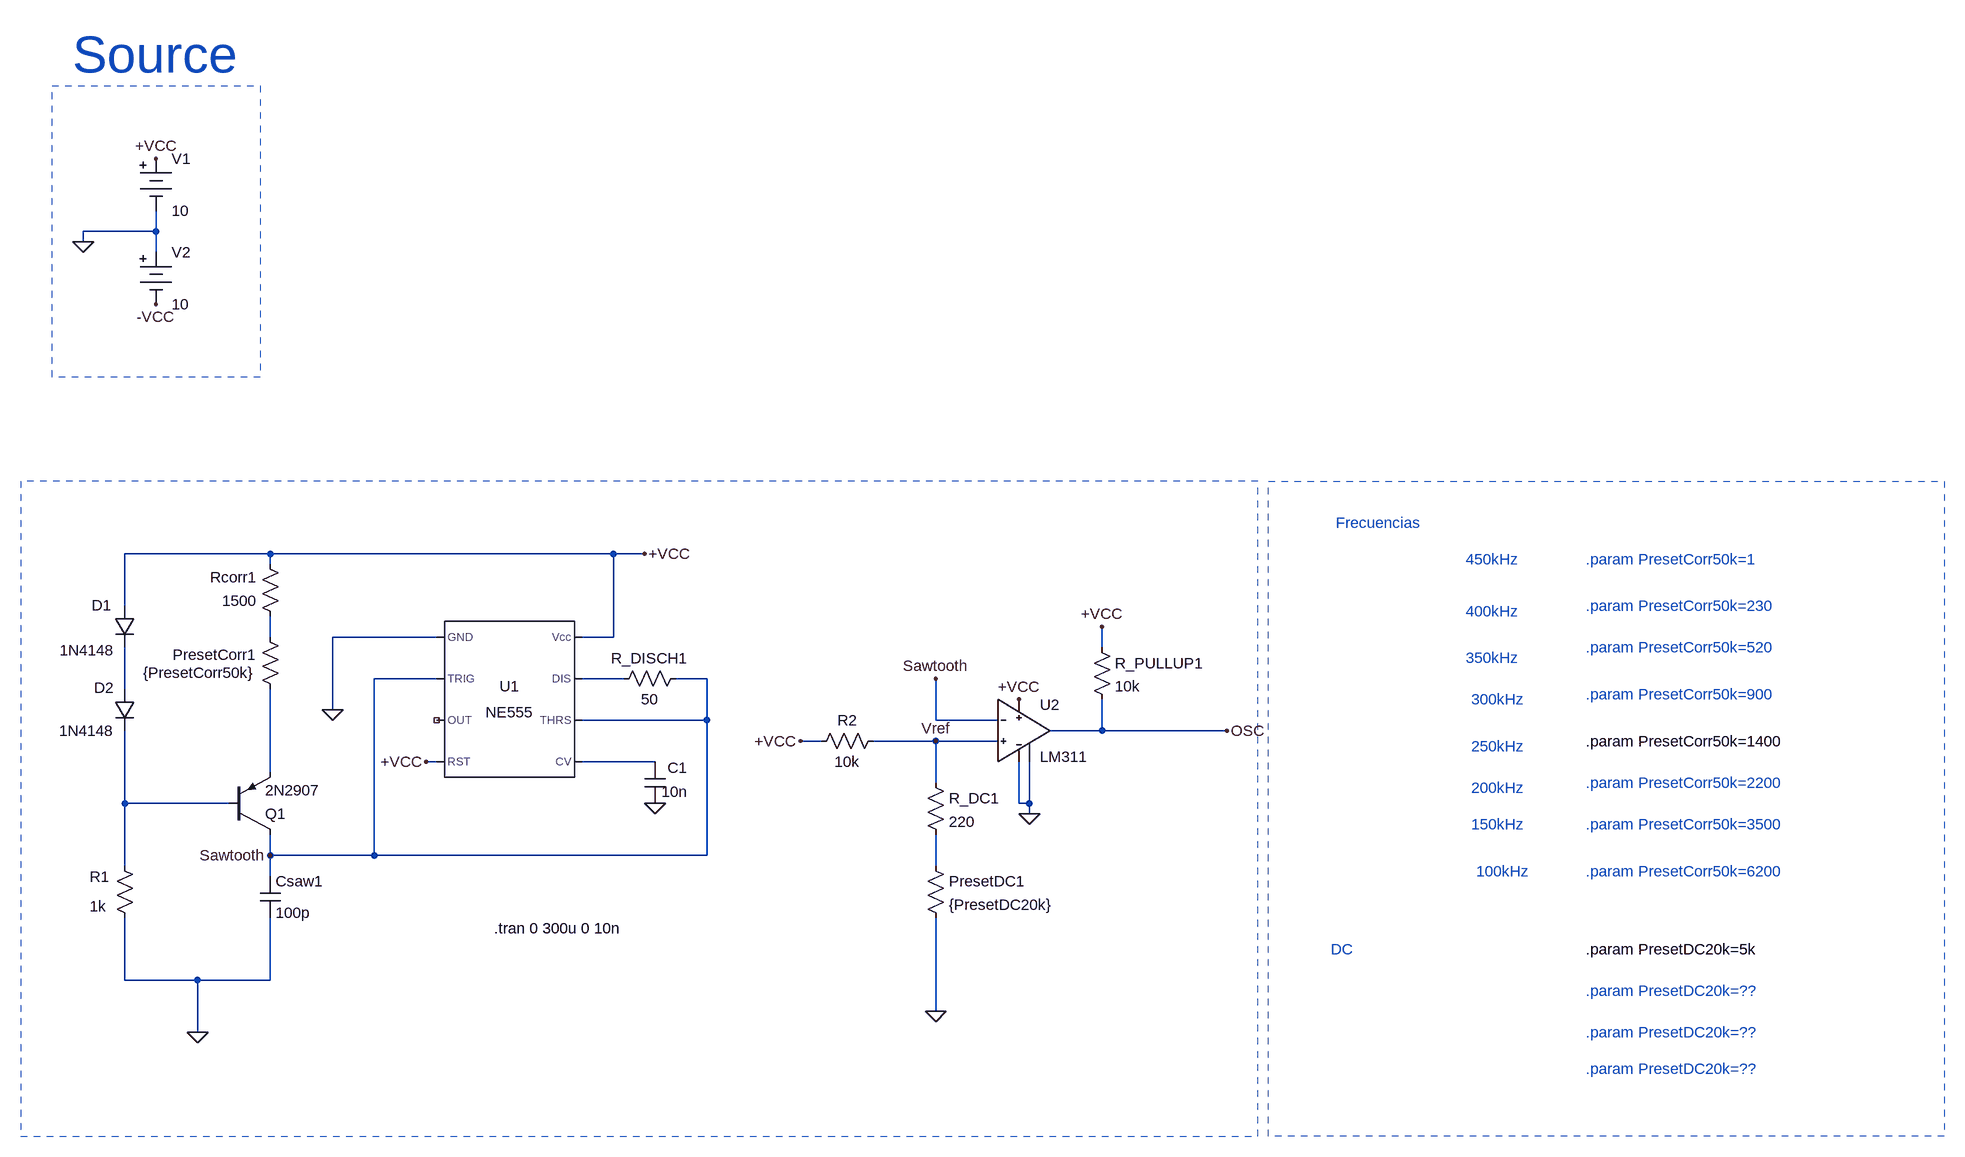
[diagram p0: schematic oscillator.asc]
oscillator.asc, the LTspice schematic file:
Version 4
SHEET 1 1492 2164
WIRE -1264 768 -1264 736
WIRE -1264 768 -1376 768
WIRE -1376 784 -1376 768
WIRE -1264 800 -1264 768
WIRE -1088 1264 -1312 1264
WIRE -560 1264 -1088 1264
WIRE -512 1264 -560 1264
WIRE -1088 1280 -1088 1264
WIRE -1312 1344 -1312 1264
WIRE -1088 1392 -1088 1360
WIRE -832 1392 -992 1392
WIRE -560 1392 -560 1264
WIRE -560 1392 -608 1392
WIRE 192 1408 192 1376
WIRE -832 1456 -928 1456
WIRE -544 1456 -608 1456
WIRE -416 1456 -464 1456
WIRE -1312 1472 -1312 1408
WIRE -992 1504 -992 1392
WIRE -416 1520 -416 1456
WIRE -416 1520 -608 1520
WIRE -64 1520 -64 1456
WIRE 32 1520 -64 1520
WIRE 192 1536 192 1488
WIRE 192 1536 112 1536
WIRE 384 1536 192 1536
WIRE -240 1552 -272 1552
WIRE -64 1552 -160 1552
WIRE 32 1552 -64 1552
WIRE -832 1584 -848 1584
WIRE -496 1584 -608 1584
WIRE -1088 1600 -1088 1472
WIRE -64 1616 -64 1552
WIRE -1312 1648 -1312 1536
WIRE -1152 1648 -1312 1648
WIRE 64 1648 64 1584
WIRE 80 1648 80 1584
WIRE 80 1648 64 1648
WIRE 80 1664 80 1648
WIRE -1088 1728 -1088 1696
WIRE -928 1728 -928 1456
WIRE -928 1728 -1088 1728
WIRE -416 1728 -416 1520
WIRE -416 1728 -928 1728
WIRE -1312 1744 -1312 1648
WIRE -64 1744 -64 1696
WIRE -1088 1760 -1088 1728
WIRE -1312 1920 -1312 1824
WIRE -1200 1920 -1312 1920
WIRE -1088 1920 -1088 1824
WIRE -1088 1920 -1200 1920
WIRE -64 1968 -64 1824
WIRE -1200 2000 -1200 1920
FLAG -496 1648 0
FLAG -1200 2000 0
FLAG -1088 1728 Sawtooth
FLAG -512 1264 +VCC
FLAG -992 1504 0
FLAG -848 1584 +VCC
FLAG -64 1456 Sawtooth
FLAG -272 1552 +VCC
FLAG -64 1968 0
FLAG 64 1488 +VCC
FLAG 384 1536 OSC
FLAG 192 1376 +VCC
FLAG 80 1664 0
FLAG -64 1552 Vref
FLAG -1264 656 +VCC
FLAG -1264 880 -VCC
FLAG -1376 784 0
DATAFLAG -544 1584 ""
DATAFLAG 288 1536 ""
SYMBOL res -448 1440 R90
WINDOW 0 0 56 VBottom 2
WINDOW 3 32 56 VTop 2
SYMATTR InstName R_DISCH1
SYMATTR Value 50
SYMBOL res -1072 1376 R180
WINDOW 0 36 76 Left 2
WINDOW 3 36 40 Left 2
SYMATTR InstName Rcorr1
SYMATTR Value 1500
SYMBOL res -1072 1488 R180
WINDOW 0 36 69 Left 2
WINDOW 3 39 41 Left 2
SYMATTR InstName PresetCorr1
SYMATTR Value {PresetCorr50k}
SYMBOL cap -1104 1760 R0
SYMATTR InstName Csaw1
SYMATTR Value 100p
SYMBOL pnp -1152 1696 M180
SYMATTR InstName Q1
SYMATTR Value 2N2907
SYMBOL res -1328 1728 R0
WINDOW 0 -38 33 Left 2
WINDOW 3 -38 78 Left 2
SYMATTR InstName R1
SYMATTR Value 1k
SYMBOL cap -512 1584 R0
WINDOW 0 35 9 Left 2
WINDOW 3 26 46 Left 2
SYMATTR InstName C1
SYMATTR Value 10n
SYMBOL res -144 1536 R90
WINDOW 0 0 56 VBottom 2
WINDOW 3 32 56 VTop 2
SYMATTR InstName R2
SYMATTR Value 10k
SYMBOL res -80 1600 R0
SYMATTR InstName R_DC1
SYMATTR Value 220
SYMBOL res -80 1728 R0
SYMATTR InstName PresetDC1
SYMATTR Value {PresetDC20k}
SYMBOL res 176 1392 R0
SYMATTR InstName R_PULLUP1
SYMATTR Value 10k
SYMBOL diode -1328 1344 R0
WINDOW 0 -35 -1 Left 2
WINDOW 3 -84 68 Left 2
SYMATTR InstName D1
SYMATTR Value 1N4148
SYMBOL diode -1328 1472 R0
WINDOW 0 -31 -2 Left 2
WINDOW 3 -85 64 Left 2
SYMATTR InstName D2
SYMATTR Value 1N4148
SYMBOL Misc\\NE555 -720 1488 R0
SYMATTR InstName U1
SYMBOL LM311 64 1536 R0
SYMATTR InstName U2
SYMBOL Misc\\battery -1264 640 R0
WINDOW 123 0 0 Left 0
WINDOW 39 0 0 Left 0
SYMATTR InstName V1
SYMATTR Value 10
SYMBOL Misc\\battery -1264 784 R0
WINDOW 123 0 0 Left 0
WINDOW 39 0 0 Left 0
SYMATTR InstName V2
SYMATTR Value 10
TEXT 936 1272 Left 2 ;.param PresetCorr50k=1
TEXT 552 1216 Left 2 ;Frecuencias
TEXT 544 1872 Left 2 ;DC
TEXT 936 1344 Left 2 ;.param PresetCorr50k=230
TEXT 936 1872 Left 2 !.param PresetDC20k=5k
TEXT 936 2000 Left 2 ;.param PresetDC20k=??
TEXT 936 2056 Left 2 ;.param PresetDC20k=??
TEXT 936 1408 Left 2 ;.param PresetCorr50k=520
TEXT 936 1480 Left 2 ;.param PresetCorr50k=900
TEXT 936 1552 Left 2 !.param PresetCorr50k=1400
TEXT 936 1616 Left 2 ;.param PresetCorr50k=2200
TEXT 936 1680 Left 2 ;.param PresetCorr50k=3500
TEXT 936 1752 Left 2 ;.param PresetCorr50k=6200
TEXT 936 1936 Left 2 ;.param PresetDC20k=??
TEXT 752 1272 Left 2 ;450kHz
TEXT 752 1352 Left 2 ;400kHz
TEXT 752 1424 Left 2 ;350kHz
TEXT 760 1488 Left 2 ;300kHz
TEXT 760 1560 Left 2 ;250kHz
TEXT 760 1624 Left 2 ;200kHz
TEXT 760 1680 Left 2 ;150kHz
TEXT 768 1752 Left 2 ;100kHz
TEXT -744 1840 Left 2 !.tran 0 300u 0 10n
TEXT -1392 496 Left 6 ;Source
RECTANGLE Normal 1488 2160 448 1152 1
RECTANGLE Normal -1472 2160 432 1152 1
RECTANGLE Normal -1104 992 -1424 544 1

The netlist it stands for:
* oscillator.asc
R_DISCH1 Sawtooth N002 50
Rcorr1 N001 +VCC 1500
R§PresetCorr1 N005 N001 {PresetCorr50k}
Csaw1 Sawtooth 0 100p
Q1 Sawtooth N006 N005 0 2N2907
R1 N006 0 1k
C1 N004 0 10n
R2 Vref +VCC 10k
R_DC1 Vref N007 220
R§PresetDC1 N007 0 {PresetDC20k}
R_PULLUP1 +VCC OSC 10k
D1 +VCC N003 1N4148
D2 N003 N006 1N4148
XU1 0 Sawtooth NC_01 +VCC N004 Sawtooth N002 +VCC NE555  ; pins GND TRIG OUT RST CV THRS DIS Vcc
XU2 Vref Sawtooth +VCC 0 OSC 0 LM311  ; pins In+ In- VCC VEE OC_OUT GND_OUT
V1 +VCC 0 10
V2 0 -VCC 10
.model D D
.lib standard.dio
.model NPN NPN
.model PNP PNP
.lib standard.bjt
* .param PresetCorr50k=1
* Frecuencias
* DC
* .param PresetCorr50k=230
.param PresetDC20k=5k
* .param PresetDC20k=??
* .param PresetDC20k=??
* .param PresetCorr50k=520
* .param PresetCorr50k=900
.param PresetCorr50k=1400
* .param PresetCorr50k=2200
* .param PresetCorr50k=3500
* .param PresetCorr50k=6200
* .param PresetDC20k=??
* 450kHz
* 400kHz
* 350kHz
* 300kHz
* 250kHz
* 200kHz
* 150kHz
* 100kHz
.tran 0 300u 0 10n
* Source
.lib NE555.sub
.lib LM311.sub
.backanno
.end